# Altium schematic sheet Power.SchDoc
size A3; SheetNumber: 5; SheetTotal: 5
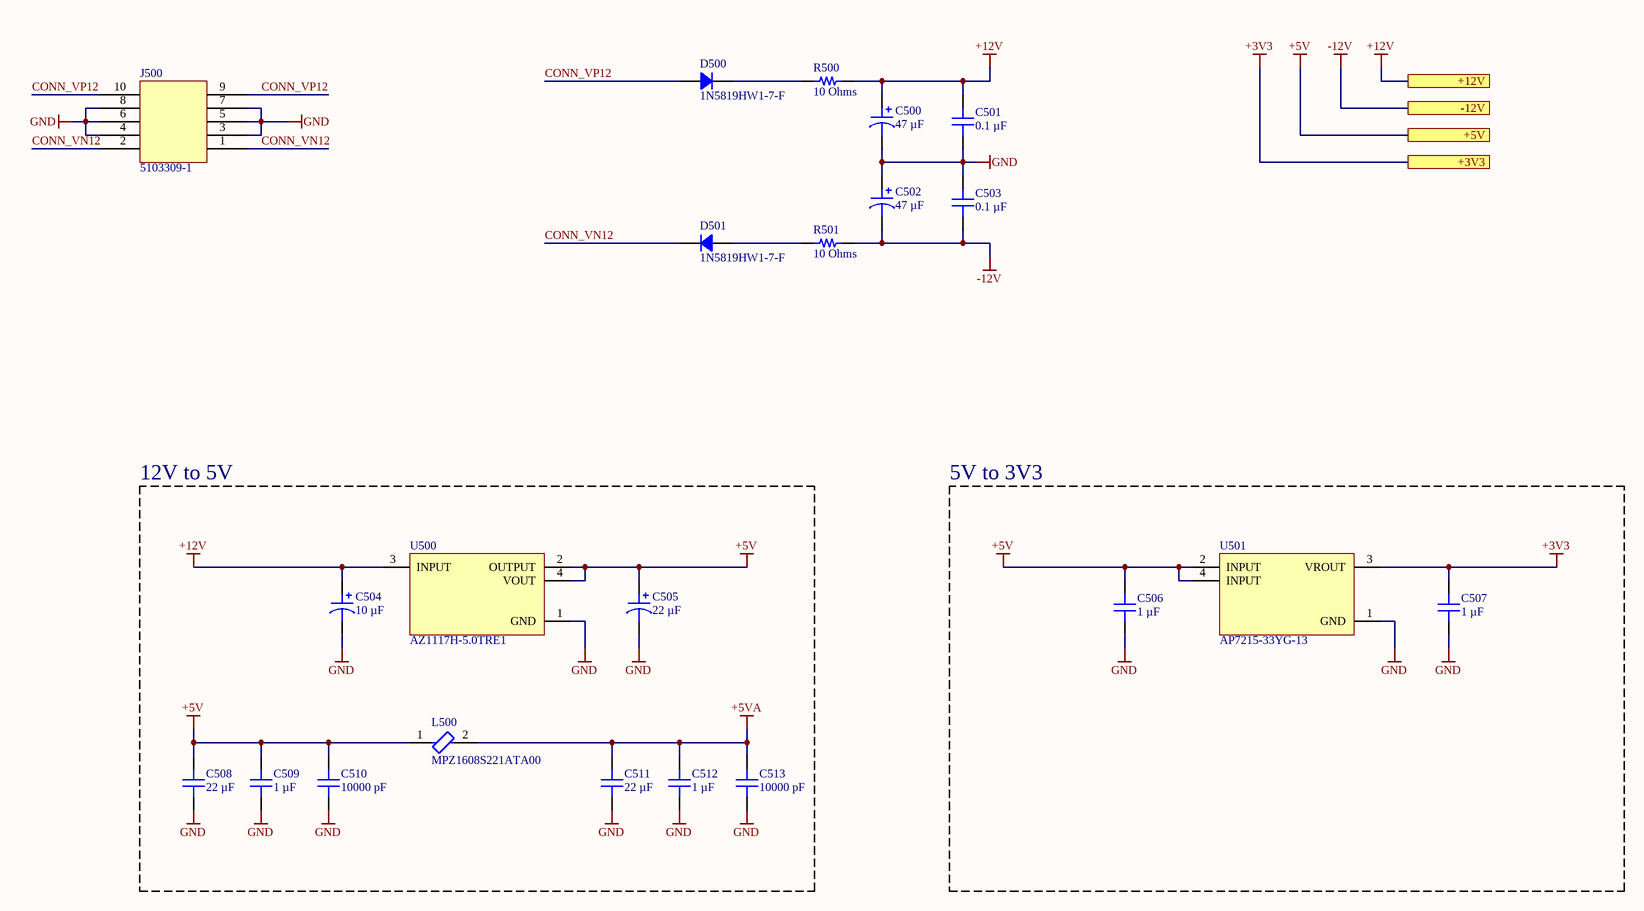
[diagram p0: Power.SchDoc]

## Parts
C500  47 µF  [CAP ALSMD 6.6MM H8.0MM]
C501  0.1 µF  [CAP 0603_1608]
C502  47 µF  [CAP ALSMD 6.6MM H8.0MM]
C503  0.1 µF  [CAP 0603_1608]
C504  10 µF  [CAP ALSMD 4.3MM H5.4MM]
C505  22 µF  [CAP ALSMD 4.3MM H5.4MM]
C506  1 µF  [CAP 0603_1608]
C507  1 µF  [CAP 0603_1608]
C508  22 µF  [CAP 1206_3216 - 0.8MM]
C509  1 µF  [CAP 0603_1608]
C510  10000 pF  [CAP 0603_1608]
C511  22 µF  [CAP 1206_3216 - 0.8MM]
C512  1 µF  [CAP 0603_1608]
C513  10000 pF  [CAP 0603_1608]
D500  1N5819HW1-7-F  [SOD123F]
D501  1N5819HW1-7-F  [SOD123F]
J500  5103309-1  [SHROUDED_PIN_HEADER_2X5]
L500  MPZ1608S221ATA00  [FP-MPZ1608-0_8-MFG]
R500  10 Ohms  [RES 0603_1608]
R501  10 Ohms  [RES 0603_1608]
U500  AZ1117H-5.0TRE1  [FP-SOT223-MFG]
U501  AP7215-33YG-13  [SOT89-3L]

## Blocks framed on the sheet
12V to 5V: C504 C505 C508-C513 L500 U500
5V to 3V3: C506 C507 U501

## Ports
+3V3, +5V, +12V, -12V

## Nets
+3V3: C507.2 U501.3(VROUT) ; port +3V3
+5V: C505.1 C506.2 C508.2 C509.2 C510.2 L500.1 U500.2(OUTPUT) U500.4(VOUT) U501.2(INPUT) U501.4(INPUT) ; port +5V
+5VA: C511.2 C512.2 C513.2 L500.2
+12V: C500.1 C501.2 C504.1 R500.2 U500.3(INPUT) ; port +12V
-12V: C502.2 C503.1 R501.2 ; port -12V
GND: C500.2 C501.1 C502.1 C503.2 C504.2 C505.2 C506.1 C507.1 C508.1 C509.1 C510.1 C511.1 C512.1 C513.1 J500.3(GND) J500.4(GND) J500.5(GND) J500.6(GND) J500.7(GND) J500.8(GND) U500.1(GND) U501.1(GND)
CONN_VN12: D501.2 J500.1(-12V) J500.2(-12V)
CONN_VP12: D500.1 J500.9(+12V) J500.10(+12V)
NetD500_2: D500.2 R500.1
NetD501_1: D501.1 R501.1

## Library data of the parts
C500 C502 = EXV476M035A9HAA: CAP ALUM 47UF 20% 35V SMD; manufacturer: KEMET; ESR (Equivalent Series Resistance): 340mOhm @ 100kHz; Impedance: 340 mOhms; Lifetime @ Temp.: 3000 Hrs @ 105°C; Polarization: Polar; Ripple Current @ High Frequency: 280 mA @ 100 kHz; Ripple Current @ Low Frequency: 196 mA @ 120 Hz; Surface Mount Land Size: 0.260" L x 0.260" W (6.60mm x 6.60mm); Part Number: EXV476M035A9HAA; Applications: General Purpose; Capacitance: 47 µF; componentlink1description: Datasheet; componentlink1url: https://api.kemet.com/component-edge/download/datasheet/EXV476M035A9HAA.pdf; componentlink2description: DigiKey Link; componentlink2url: https://www.digikey.com/en/products/detail/kemet/EXV476M035A9HAA/9354316; Device Package: Radial, Can - SMD; Height - Seated (Max): 0.315" (8.00mm); lastupdated: 03/06/2024 20:16:27; Lifecycle Status: Active; Minimum Order: 1; Mounting Type: Surface Mount; Operating Temperature: -55°C ~ 105°C; Package / Case: Radial, Can - SMD; packaging: TapeAndReel; partid: 27270; Part Status: Active; price: 0.16; series: EXV; Size / Dimension: 0.248" Dia (6.30mm); Supplier 1: DigiKey; Supplier Part Number 1: 399-18149-1-ND; Tolerance: ±20%; value: 47 µF; Voltage - Rated: 35 V
C501 C503 = CC0603MRY5V8BB104: CAP CER 0.1UF 25V Y5V 0603; manufacturer: Yageo; Temperature Coefficient: Y5V (F); Tolerance: ±20%; Part Number: CC0603MRY5V8BB104; Value: 0.1 µF; Applications: General Purpose; Capacitance: 0.1 µF; componentlink1description: Datasheet; componentlink1url: http://www.yageo.com/documents/recent/UPY-GPHC_Y5V_6.3V-to-50V_8.pdf; componentlink2description: DigiKey Link; componentlink2url: https://www.digikey.com/en/products/detail/yageo/CC0603MRY5V8BB104/2103101; Device Package: 0603 (1608 Metric); lastupdated: 09/02/2024 20:10:27; Lifecycle Status: Active; Minimum Order: 1; Mounting Type: Surface Mount, MLCC; Operating Temperature: -30°C ~ 85°C; Package / Case: 0603 (1608 Metric); packaging: TapeAndReel; partid: 5132; Part Status: Active; price: 0.01; series: CC; Size / Dimension: 0.063" L x 0.031" W (1.60mm x 0.80mm); Supplier 1: DigiKey; Supplier Part Number 1: 311-1363-1-ND; Thickness (Max): 0.035" (0.90mm); Voltage - Rated: 25V
C504 = UWX1C100MCL1GB: CAP ALUM 10UF 20% 16V SMD; manufacturer: Nichicon; Lifetime @ Temp.: 2000 Hrs @ 85°C; Polarization: Polar; Ripple Current @ High Frequency: 34.5 mA @ 10 kHz; Ripple Current @ Low Frequency: 23 mA @ 120 Hz; Surface Mount Land Size: 0.169" L x 0.169" W (4.30mm x 4.30mm); Part Number: UWX1C100MCL1GB; Applications: General Purpose; Capacitance: 10 µF; componentlink1description: Datasheet; componentlink1url: https://products.nichicon.co.jp/en/pdf/XJA043/e-uwx.pdf; componentlink2description: DigiKey Link; componentlink2url: https://www.digikey.com/en/products/detail/nichicon/UWX1C100MCL1GB/589841; Device Package: Radial, Can - SMD; Height - Seated (Max): 0.213" (5.40mm); lastupdated: 03/06/2024 19:53:00; Lifecycle Status: Active; Minimum Order: 1; Mounting Type: Surface Mount; Operating Temperature: -40°C ~ 85°C; Package / Case: Radial, Can - SMD; packaging: TapeAndReel; partid: 7030; Part Status: Active; price: 0.06; series: UWX; Size / Dimension: 0.157" Dia (4.00mm); Supplier 1: DigiKey; Supplier Part Number 1: 493-2100-1-ND; Tolerance: ±20%; value: 10 µF; Voltage - Rated: 16 V
C505 = UWT0G220MCL1GB: CAP ALUM 22UF 20% 4V SMD; manufacturer: Nichicon; Lifetime @ Temp.: 1000 Hrs @ 105°C; Polarization: Polar; Ripple Current @ High Frequency: 33 mA @ 10 kHz; Ripple Current @ Low Frequency: 22 mA @ 120 Hz; Surface Mount Land Size: 0.169" L x 0.169" W (4.30mm x 4.30mm); Part Number: UWT0G220MCL1GB; Applications: General Purpose; Capacitance: 22 µF; componentlink1description: Datasheet; componentlink1url: https://products.nichicon.co.jp/en/pdf/XJA043/e-uwt.pdf; componentlink2description: DigiKey Link; componentlink2url: https://www.digikey.com/en/products/detail/nichicon/UWT0G220MCL1GB/589879; Device Package: Radial, Can - SMD; Height - Seated (Max): 0.213" (5.40mm); lastupdated: 03/06/2024 19:52:57; Lifecycle Status: Active; Minimum Order: 1; Mounting Type: Surface Mount; Operating Temperature: -55°C ~ 105°C; Package / Case: Radial, Can - SMD; packaging: TapeAndReel; partid: 7089; Part Status: Active; price: 0.06; series: UWT; Size / Dimension: 0.157" Dia (4.00mm); Supplier 1: DigiKey; Supplier Part Number 1: 493-2138-1-ND; Tolerance: ±20%; value: 22 µF; Voltage - Rated: 4 V
C506 C507 C509 C512 = CC0603KRX7R6BB105: CAP CER 1UF 10V X7R 0603; manufacturer: Yageo; Tolerance: ±10%; Part Number: CC0603KRX7R6BB105; Value: 1 µF; Applications: General Purpose; Capacitance: 1 µF; componentlink1description: Datasheet; componentlink1url: https://www.yageo.com/upload/media/product/productsearch/datasheet/mlcc/UPY-GPHC_X7R_6.3V-to-50V_18.pdf; componentlink2description: DigiKey Link; componentlink2url: https://www.digikey.com/en/products/detail/yageo/CC0603KRX7R6BB105/5195204; Device Package: 0603 (1608 Metric); lastupdated: 09/02/2024 20:10:30; Lifecycle Status: Active; Minimum Order: 1; Mounting Type: Surface Mount, MLCC; Operating Temperature: -55°C ~ 125°C; Package / Case: 0603 (1608 Metric); packaging: TapeAndReel; partid: 2290; Part Status: Active; price: 0.01; series: CC; Size / Dimension: 0.063" L x 0.031" W (1.60mm x 0.80mm); Supplier 1: DigiKey; Supplier Part Number 1: 311-1796-1-ND; Temperature Coefficient: X7R; Thickness (Max): 0.035" (0.90mm); Voltage - Rated: 10V
C508 C511 = CC1206MKX5R5BB226: CAP CER 22UF 6.3V X5R 1206; manufacturer: Yageo; Tolerance: ±20%; Part Number: CC1206MKX5R5BB226; Value: 22 µF; Applications: General Purpose; Capacitance: 22 µF; componentlink1description: Datasheet; componentlink1url: https://www.yageo.com/upload/media/product/productsearch/datasheet/mlcc/UPY-GPHC_X5R_4V-to-50V_25.pdf; componentlink2description: DigiKey Link; componentlink2url: https://www.digikey.com/en/products/detail/yageo/CC1206MKX5R5BB226/5195398; Device Package: 1206 (3216 Metric); lastupdated: 04/06/2024 19:10:40; Lifecycle Status: Active; Minimum Order: 1; Mounting Type: Surface Mount, MLCC; Operating Temperature: -55°C ~ 85°C; Package / Case: 1206 (3216 Metric); packaging: TapeAndReel; partid: 19995; Part Status: Active; price: 0.05; series: CC; Size / Dimension: 0.126" L x 0.063" W (3.20mm x 1.60mm); Supplier 1: DigiKey; Supplier Part Number 1: 311-1992-1-ND; Temperature Coefficient: X5R; Thickness (Max): 0.071" (1.80mm); Voltage - Rated: 6.3V
C510 C513 = CC0603JRX7R9BB103: CAP CER 10000PF 50V X7R 0603; manufacturer: Yageo; Tolerance: ±5%; Part Number: CC0603JRX7R9BB103; Value: 10000 pF; Applications: General Purpose; Capacitance: 10000 pF; componentlink1description: Datasheet; componentlink1url: https://www.yageo.com/upload/media/product/productsearch/datasheet/mlcc/UPY-GPHC_X7R_6.3V-to-50V_18.pdf; componentlink2description: DigiKey Link; componentlink2url: https://www.digikey.com/en/products/detail/yageo/CC0603JRX7R9BB103/5195187; Device Package: 0603 (1608 Metric); lastupdated: 09/02/2024 20:10:26; Lifecycle Status: Active; Minimum Order: 1; Mounting Type: Surface Mount, MLCC; Operating Temperature: -55°C ~ 125°C; Package / Case: 0603 (1608 Metric); packaging: TapeAndReel; partid: 5230; Part Status: Active; price: 0.01; series: CC; Size / Dimension: 0.063" L x 0.031" W (1.60mm x 0.80mm); Supplier 1: DigiKey; Supplier Part Number 1: 311-1778-1-ND; Temperature Coefficient: X7R; Thickness (Max): 0.035" (0.90mm); Voltage - Rated: 50V
D500 D501 = 1N5819HW1-7-F: DIODE SBR 40V 1A SOD123F; Manufacturer: Diodes Incorporated; Capacitance @ Vr, F: 30pF @ 10V, 1MHz; Current - Reverse Leakage @ Vr: 500 µA @ 40 V; Diode Type: Super Barrier; Reverse Recovery Time (trr): 15 ns; Speed: Fast Recovery =< 500ns, > 200mA (Io); Voltage - Forward (Vf) (Max) @ If: 510 mV @ 1 A; Part Number: 1N5819HW1-7-F; ComponentLink1Description: Datasheet; ComponentLink1URL: https://www.diodes.com/assets/Datasheets/1N5819HW1.pdf; ComponentLink2Description: DigiKey Link; ComponentLink2URL: https://www.digikey.com/en/products/detail/diodes-incorporated/1N5819HW1-7-F/5768523; Current - Average Rectified (Io): 1A; LastUpdated: 03/06/2024 19:54:57; Lifecycle Status: Active; Minimum Order: 1; Mounting Type: Surface Mount; Operating Temperature - Junction: -55°C ~ 125°C; Package / Case: SOD-123F; Packaging: TapeAndReel; PartId: 2408; Part Status: Active; Price: 0.08; Series: SBR®; Supplier 1: DigiKey; Supplier Part Number 1: 1N5819HW1-7-FDICT-ND; Supplier Device Package: SOD-123F; Voltage - DC Reverse (Vr) (Max): 40 V
J500 = 5103309-1: Headers & Wire Housings HDR VERT DOUBLE 10P low profile; Supplier 1: Farnell; Supplier Part Number 1: 2396199
L500 = CMP-08257-000028-1: Power line Ferrite Bead 220Ω @ 100MHz 2.2A DCR 0.05Ω SMD 0603; DC Resistance (DCR): 50mR; Tolerance: 25%; Impedance: 220R; Series: MPZ; Width: 0.031inch; REACH SVHC: No SVHC; Case Code (Imperial): 0603; Current Rating: 2.2A; Case/Package: 0603; Packaging: Cut Tape; Height: 0.037inch; Number of Pins: 2; Max DC Current: 2.2A; Lead Free: Lead Free; RoHS Compliant: Yes; Mount: Surface Mount; Case Code (Metric): 1608; Length: 0.063inch; Package Quantity: 1; Core Material: Ferrite
R500 R501 = CRCW060310R0FKEAC: RES 10 OHM 1% 1/10W 0603; Manufacturer: Vishay Dale; Power (Watts): 0.1W, 1/10W; Temperature Coefficient: ±100ppm/°C; Part Number: CRCW060310R0FKEAC; Value: 10 Ohms; ComponentLink1Description: Datasheet; ComponentLink1URL: http://www.vishay.com/docs/28773/crcwce3.pdf; ComponentLink2Description: DigiKey Link; ComponentLink2URL: https://www.digikey.com/en/products/detail/vishay-dale/CRCW060310R0FKEAC/7928374; Composition: Thick Film; Device Package: 0603 (1608 Metric); Height - Seated (Max): 0.022" (0.55mm); LastUpdated: 09/02/2024 20:43:06; Lifecycle Status: Active; Minimum Order: 1; Number of Terminations: 2; Operating Temperature: -55°C ~ 155°C; Package / Case: 0603 (1608 Metric); Packaging: CutTape; PartId: 12557; Part Status: Active; Price: 0.01; Resistance: 10 Ohms; Series: CRCW-C; Supplier 1: DigiKey; Supplier Part Number 1: 541-3952-1-ND; Supplier Device Package: 0603; Tolerance: ±1%
U500 = AZ1117H-5.0TRE1: IC REG LINEAR 5V 1A SOT223; Min Current Limit: 1.25A; Quiescent Current: 10mA; Output Voltage: 5.0; Reference Voltage: 1.25V; Polarity: Positive; Max Input Voltage: 15V; Number of Outputs: 1; Dropout Voltage: 1.15V; Accuracy: 1%; Power Supply Rejection Ratio (PSRR): 75dB; Output Type: Fixed; Case/Package: TO-261-4; Package Quantity: 4000; Min Operating Temperature: -40°C; Max Output Current: 1A; Max Operating Temperature: 125°C; Weight: 0.000282oz; Output Current: 1A; Packaging: Tape and Reel; Mount: Surface Mount; Lead Free: Lead Free; Number of Regulators: 1; Supplier 1: Digikey; Supplier Part Number 1: 31-AZ1117H-5.0TRE1CT-ND
U501 = AP7215-33YG-13: LDO Voltage Regulators SOT89-3L 3.3V/0.6A 250MV 3.3-5.5V 1.2V; Supplier 1: Digikey; Supplier Part Number 1: AP7215-33YG-13DICT-ND